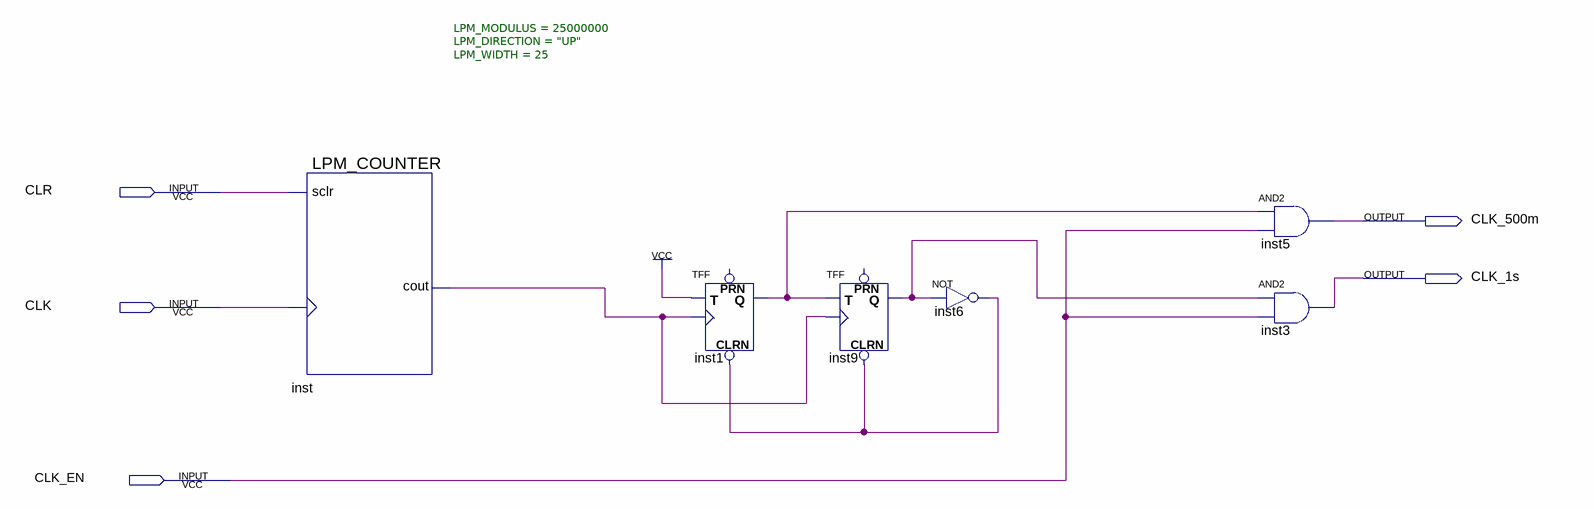
[diagram p0: schematic sheet]
// Quartus schematic clk_500m_1s.bdf as structural Verilog: 6 symbols, 5 pins
module clk_500m_1s (
  input  CLR,
  input  CLK,
  input  CLK_EN,
  output CLK_500m,
  output CLK_1s
);

  wire inst1_q, inst6_out, inst9_q, inst_cout;

  LPM_COUNTER #(.LPM_MODULUS(25000000), .LPM_DIRECTION("UP"), .LPM_WIDTH(25)) inst (
    .clock(CLK), .sclr(CLR), .cout(inst_cout));
  TFF inst1 (.CLRN(inst6_out), .T(1'b1), .CLK(inst_cout), .Q(inst1_q));  // open: PRN
  TFF inst9 (.CLRN(inst6_out), .T(inst1_q), .CLK(inst_cout), .Q(inst9_q));  // open: PRN
  not inst6 (inst6_out, inst9_q);
  and inst5 (CLK_500m, inst1_q, CLK_EN);
  and inst3 (CLK_1s, inst9_q, CLK_EN);
endmodule
